# EAGLE board AQ_sensor_GSM (EAGLE 9.6.2), part 1 of 2
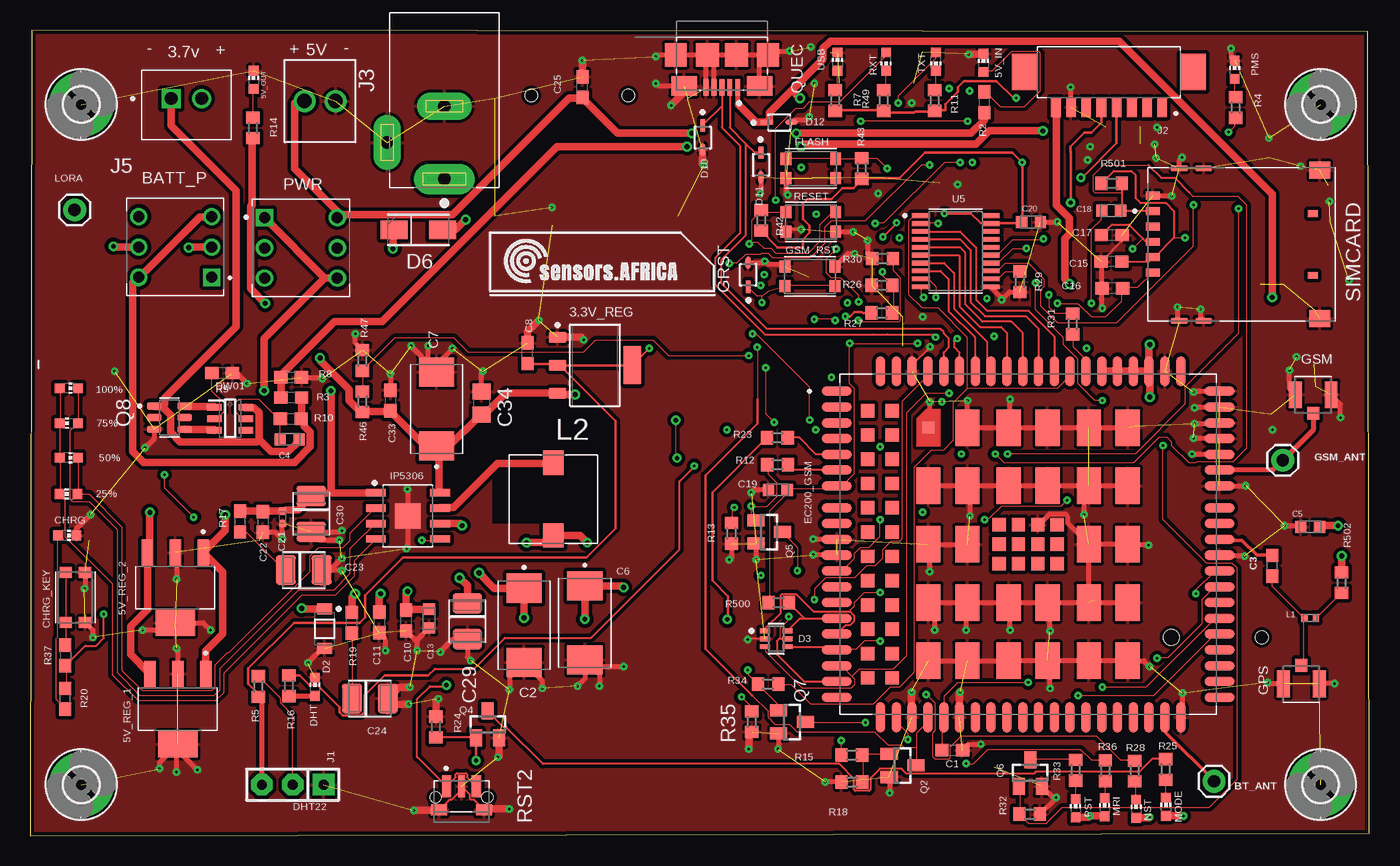
[diagram p8: board, top side]
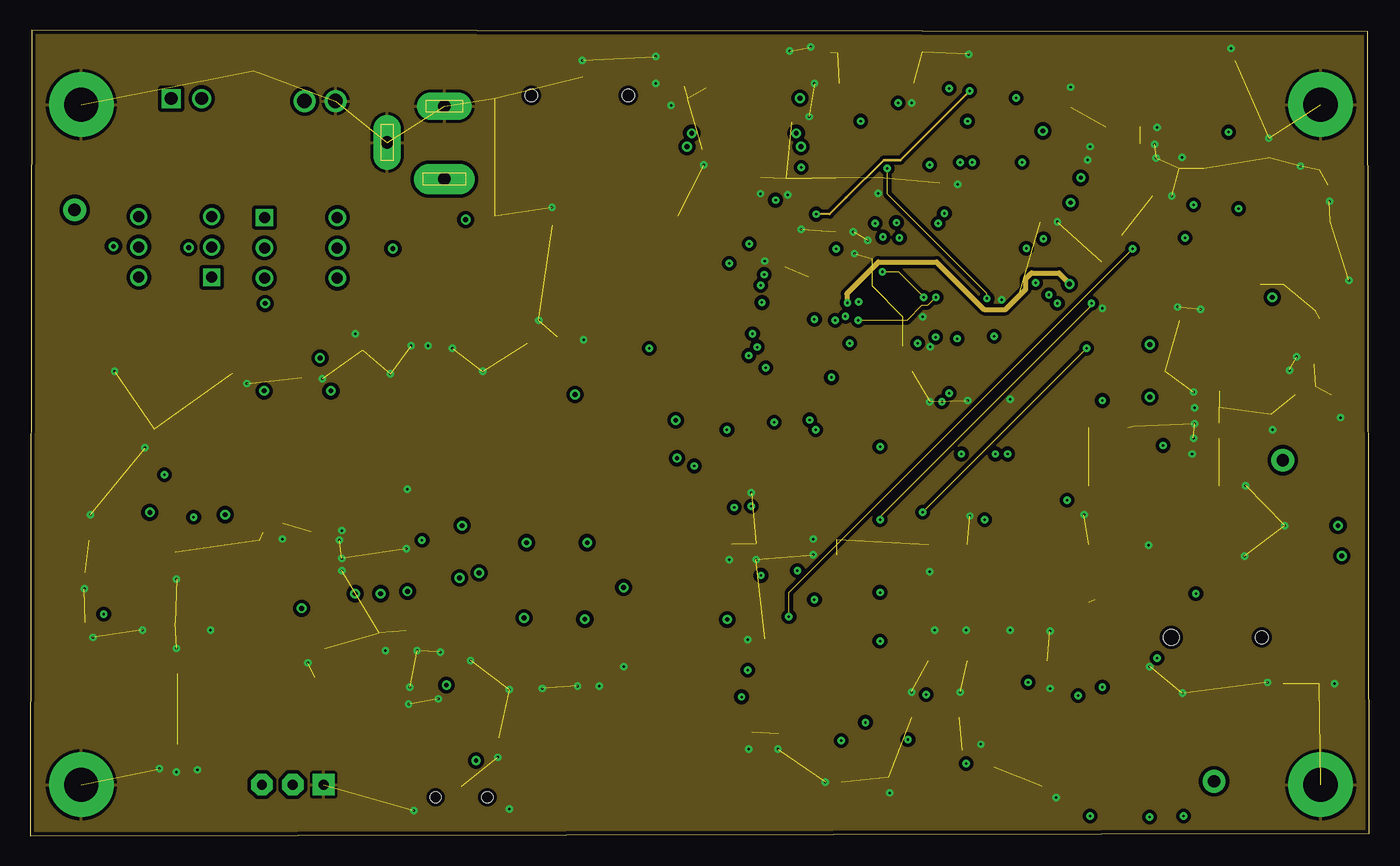
[diagram p9: board, inner layer GND]
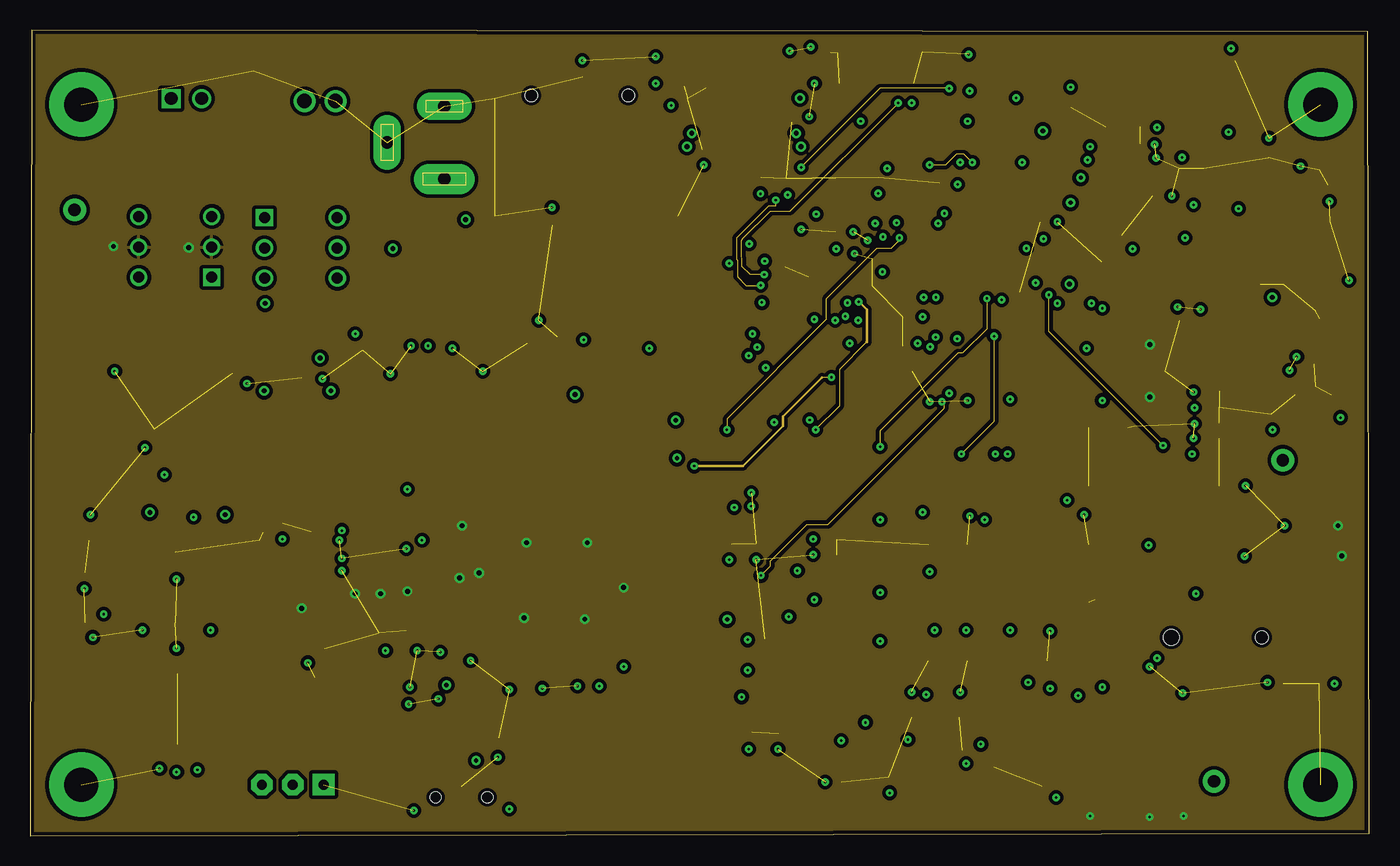
[diagram p10: board, inner layer V_LIPO]
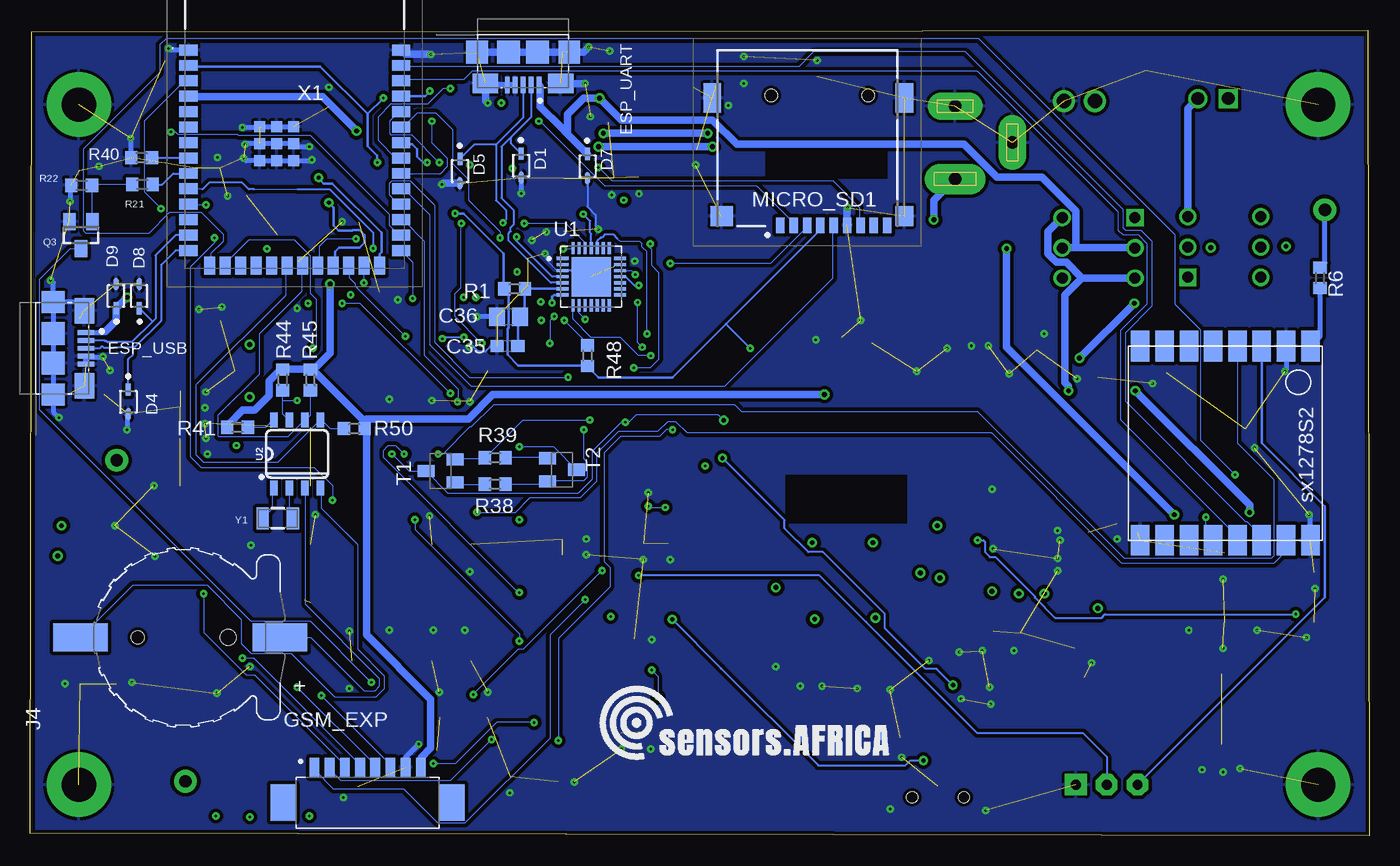
[diagram p11: board, bottom side, seen from below]

Size 110.2 x 66.3 mm. Coordinates in mm from the lower left corner, seen from the top.
Outline: 110.1,66.2 0.1,66.3 0,0 110.2,0.2 110.1,66.2
Copper layers (1+2*15+16): Top 0.035mm / dielectric 1.5mm / GND 0.035mm / dielectric 0.15mm / V_LIPO 0.035mm / dielectric 0.2mm / Bottom 0.035mm
Design rules "default *": minimum track width 0.1mm, minimum drill 0.15mm, track to track 0.3mm, track to pad 0.1mm, pad to pad 0.2mm, via to via 0.3mm, smd to smd 0.3mm, copper to edge 0.3mm, drill to drill 0.3mm, minimum pad ring 10mil, minimum via ring 8mil, stop-mask expansion 4mil, vias tented up to drill 0mil, thermal gap 10mil
Net classes: 0 default: width 0.1 mm, drill 0.2 mm, clearance 0.1 mm; 1 POWER: width 0.2 mm, drill 0.2 mm, clearance 0.2 mm to class 0, clearance 0.2 mm; 2 BGA: width 0.1 mm, drill 0.2 mm; 3 HCurrent: width 0.2 mm, drill 0.2 mm, clearance 0.2 mm to class 0; 4 Antenna: width 0.3 mm, drill 0.2 mm, clearance 0.2 mm to class 0

## Footprints (pad centres in the part's own frame; a part is rotated, then mirrored left to right if it is on the bottom)
TEXAS_INSTRUMENTS_LM1117IMP-3.3-NOPB_0 = smd 1.45 x 0.9: 1 -3.075,2.3; 2 -3.075,0; 3 -3.075,-2.3 | smd 1.45 x 3.15: 4 3.075,0
TERMBLK_254-2N = drill 1.2: 1 0,0; 2 2.54,0
CHIP-LED0603 = smd 0.8 x 0.8: A 0,-0.75; C 0,0.75
VREG_LM7805MPX/NOPB = smd 2.15 x 0.95: 1 -2.9,2.3; 2 -2.9,0; 3 -2.9,-2.3 | smd 2.15 x 3.25: 4 2.9,0
SW_TL2285EE = drill 0.9 square: 1 -2.5,-3 | drill 0.9: 2 0,-3; 3 2.5,-3; 4 -2.5,3; 5 0,3; 6 2.5,3
1X01 = drill 1.016 pad 1.88: 1 0,0
0603 = smd 1.1 x 1: 1 -0.85,0; 2 0.85,0
CAP_20TQC100MYF = smd 2.4 x 2.9: 1 -3.05,0; 2 3.05,0
CAPC1608X90N = smd 0.92 x 0.98: 1 -0.775,0; 2 0.775,0
C0603 = smd 1.1 x 1: 1 -0.85,0; 2 0.85,0
0402-TIGHT = smd 0.6 x 0.6: 1 -0.5,0; 2 0.5,0
CAP_TANT_B = smd 1.66 x 2.42: 1 -1.475,0; 2 1.475,0
C0805 = smd 1.3 x 1.5: 1 -0.95,0; 2 0.95,0
SW_KMR621NGLFS = smd 0.9 x 1: 1_1 -2.05,0.8; 1_2 2.05,0.8; 2_1 -2.05,-0.8; 2_2 2.05,-0.8
ON_SEMI_1N4148WS_0 = smd 1.006 x 0.392: 1 -1,0; 2 1,0
ON_SEMICONDUCTOR_MMSZ5231BT1G_0 = smd 0.91 x 1.22: 1 -1.635,0; 2 1.635,0
SEMTECH_SMF05C_0 = smd 0.85 x 0.4: 1 -0.925,0.65; 2 -0.925,0; 3 -0.925,-0.65; 4 0.925,-0.65; 5 0.925,0; 6 0.925,0.65
DIOM5025X220N = smd 2.25 x 1.55: 1 -2,0; 2 2,0
SOT23-6L = smd 0.55 x 1.2: 1 -0.95,-1.3; 2 0,-1.3; 3 0.95,-1.3; 4 0.95,1.3; 5 0,1.3; 6 -0.95,1.3
XCVR_EC200UCNAB-N05-SNNSA = smd 2.5 x 0.8: 1 -15.75,12.6; 2 -15.75,11.3; 3 -15.75,10; 4 -15.75,8.7; 5 -15.75,7.4; 6 -15.75,6.1; 7 -15.75,4.8; 8 -15.75,0.4; 9 -15.75,-0.9; 10 -15.75,-2.2; 11 -15.75,-3.5; 12 -15.75,-4.8; 13 -15.75,-6.1; 14 -15.75,-7.4; 15 -15.75,-8.7; 16 -15.75,-10; 17 -15.75,-11.3; 18 -15.75,-12.6; 37 15.75,-12.6; 38 15.75,-11.3; 39 15.75,-10; 40 15.75,-8.7; 41 15.75,-7.4; 42 15.75,-6.1; 43 15.75,-4.8; 44 15.75,-3.5; 45 15.75,-2.2; 46 15.75,-0.9; 47 15.75,0.4; 48 15.75,4.8; 49 15.75,6.1; 50 15.75,7.4; 51 15.75,8.7; 52 15.75,10; 53 15.75,11.3; 54 15.75,12.6; 141 -15.75,3; 142 -15.75,1.7; 143 15.75,1.7; 144 15.75,3 | smd 0.8 x 2.5: 19 -9.55,-14.25; 20 -8.25,-14.25; 21 -6.95,-14.25; 22 -5.65,-14.25; 23 -4.35,-14.25; 24 -3.05,-14.25; 25 -1.75,-14.25; 26 -0.45,-14.25; 27 0.85,-14.25; 28 2.15,-14.25; 29 3.45,-14.25; 30 4.75,-14.25; 31 6.05,-14.25; 32 7.35,-14.25; 33 8.65,-14.25; 34 9.95,-14.25; 35 11.25,-14.25; 36 12.55,-14.25; 55 12.55,14.25; 56 11.25,14.25; 57 9.95,14.25; 58 8.65,14.25; 59 7.35,14.25; 60 6.05,14.25; 61 4.75,14.25; 62 3.45,14.25; 63 2.15,14.25; 64 0.85,14.25; 65 -0.45,14.25; 66 -1.75,14.25; 67 -3.05,14.25; 68 -4.35,14.25; 69 -5.65,14.25; 70 -6.95,14.25; 71 -8.25,14.25; 72 -9.55,14.25; 113 -10.85,14.25; 114 -12.15,14.25; 115 -10.85,-14.25; 116 -12.15,-14.25 | smd 1.1 x 1.1: 73 2.4,1.6; 74 2.4,0; 75 2.4,-1.6; 76 0.8,1.6; 77 0.8,0; 78 0.8,-1.6; 79 -0.8,1.6; 80 -0.8,0; 81 -0.8,-1.6; 82 -2.4,1.6; 83 -2.4,0; 84 -2.4,-1.6; 117 -11.2,11; 118 -11.2,9; 119 -11.2,7; 120 -11.2,5; 121 -11.2,3; 122 -11.2,1; 123 -11.2,-1; 124 -11.2,-3; 125 -11.2,-5; 126 -11.2,-7; 127 -11.2,-9; 128 -11.2,-11; 129 -13.2,11; 130 -13.2,9; 131 -13.2,7; 132 -13.2,5; 133 -13.2,3; 134 -13.2,1; 135 -13.2,-1; 136 -13.2,-3; 137 -13.2,-5; 138 -13.2,-7; 139 -13.2,-9; 140 -13.2,-11 | smd 2 x 3: 85 8.2,9.6; 86 8.2,4.8; 87 8.2,0; 88 8.2,-4.8; 89 8.2,-9.6; 90 5,9.6; 91 5,4.8; 92 5,0; 93 5,-4.8; 94 5,-9.6; 95 1.6,9.6; 96 1.6,4.8; 97 1.6,-4.8; 98 1.6,-9.6; 99 -1.6,9.6; 100 -1.6,4.8; 101 -1.6,-4.8; 102 -1.6,-9.6; 103 -5,9.6; 104 -5,4.8; 105 -5,0; 106 -5,-4.8; 107 -5,-9.6; 109 -8.2,4.8; 110 -8.2,0; 111 -8.2,-4.8; 112 -8.2,-9.6 | smd 1 x 1: 108 -8.2,9.6
AMPHENOL_10118192-0001LF = smd 0.4 x 1.35: 1 -1.3,0; 2 -0.65,0; 3 0,0; 4 0.65,0; 5 1.3,0 | smd 2.1 x 1.6: SH1 -3.1,-0.125; SH2 3.1,-0.125 | smd 1.8 x 1.9: SH3 -3.8,-2.675; SH6 3.8,-2.675 | smd 1.9 x 1.9: SH4 -1.2,-2.675; SH5 1.2,-2.675
TE_1909763-1 = smd 1 x 1.05: 1 0,-1.525 | smd 1.05 x 2.2: 2 -1.475,0; 3 1.475,0
MOLEX_53261-0871 = smd 0.8 x 1.6: 1 -4.375,2.9; 2 -3.125,2.9; 3 -1.875,2.9; 4 -0.625,2.9; 5 0.625,2.9; 6 1.875,2.9; 7 3.125,2.9; 8 4.375,2.9 | smd 2.1 x 3: S1 -6.925,0; S2 6.925,0
2,8-PAD = drill 2.8 pad 5.334: B2,8 0,0
SOIC127P600X165-9T209N = smd 1.609 x 0.594: 1 -2.653,1.905; 2 -2.653,0.635; 3 -2.653,-0.635; 4 -2.653,-1.905; 5 2.653,-1.905; 6 2.653,-0.635; 7 2.653,0.635; 8 2.653,1.905 | smd 2.09 x 2.09: 9 0,0
SIP-100-03-32 = drill 0.813 pad 1.778 square: 1 -2.54,0 | drill 0.813 pad 1.778 octagon: 2 0,0; 3 2.54,0
CUI_PJ-002BH = drill 1 pad 2.5 long: 1 0,0 | drill 1 pad 2.25 long: 2 6,0; 3 3,4.7
HARWIN_S8411-45R = smd 2.3 x 4.5: N 0,8.425; P 0,-7.975 | hole 1.05: 0,3.725 | hole 1.3: 0,-3.725
JST_B2B-XH-A = drill 1.05 square: 1 1.25,-0.525 | drill 1.05: 2 -1.25,-0.525
INDC1005X60N = smd 0.51 x 0.63: 1 -0.46,0; 2 0.46,0
784778010 = smd 1.7 x 2: 1 0,3; 2 0,-3
TF-01A = smd 0.7 x 1.3: 1 2.23,7.174; 2 1.13,7.174; 3 0.03,7.174; 4 -1.07,7.174; 5 -2.17,7.174; 6 -3.27,7.174; 7 -4.37,7.174; 8 -5.47,7.174; CD1 -6.57,7.174 | smd 1.448 x 1.651: MP1 -7.989,6.4 | smd 1.448 x 2.438: MP2 -7.989,-3.3; MP3 7.836,-3.3 | smd 1.854 x 1.651: MP4 7.061,6.4 | hole 1: -5.004,-3.531; 2.972,-3.531
SOT23-BEC = smd 1 x 1.4: B -0.95,-1.1; C 0,1.1; E 0.95,-1.1
SOT95P280X145-6N = smd 1.21 x 0.59: 1 -1.255,0.95; 2 -1.255,0; 3 -1.255,-0.95; 4 1.255,-0.95; 5 1.255,0; 6 1.255,0.95
R0603 = smd 1 x 1.1: 1 -0.85,0; 2 0.85,0
SW_SKRTLAE010 = smd 0.75 x 1.8: 1 -1.225,0.9; 3 1.225,0.9 | smd 0.6 x 1.8: 2 0,0.9 | smd 1.3 x 0.9: S1 -1.85,-1.05; S2 1.85,-1.05 | hole 0.9: -2.125,0; 2.125,0
MOLEX_78646-3001 = smd 1.15 x 0.65: C1 -7.295,2.755; C2 -7.295,0.215; C3 -7.295,-2.325; C5 -7.295,4.025; C6 -7.295,1.485; C7 -7.295,-1.055 | smd 1.3 x 0.45: G1 -5.125,6.27; G2 -3.125,6.27; G3 -5.125,-6.27; G4 -3.125,-6.27 | smd 1.7 x 1.4: G5 6.435,-6.105; G6 6.435,6.105 | smd 0.8 x 0.54: X1 5.855,2.54; X2 5.855,-2.54
SC59-BEC = smd 1 x 1.4: B -0.95,-1.2; C 0,1.2; E 0.95,-1.2
QFN50P500X500X80-29N = smd 0.99 x 0.27: 1 -2.36,1.5; 2 -2.36,1; 3 -2.36,0.5; 4 -2.36,0; 5 -2.36,-0.5; 6 -2.36,-1; 7 -2.36,-1.5; 15 2.36,-1.5; 16 2.36,-1; 17 2.36,-0.5; 18 2.36,0; 19 2.36,0.5; 20 2.36,1; 21 2.36,1.5 | smd 0.27 x 0.99: 8 -1.5,-2.36; 9 -1,-2.36; 10 -0.5,-2.36; 11 0,-2.36; 12 0.5,-2.36; 13 1,-2.36; 14 1.5,-2.36; 22 1.5,2.36; 23 1,2.36; 24 0.5,2.36; 25 0,2.36; 26 -0.5,2.36; 27 -1,2.36; 28 -1.5,2.36 | smd 3.25 x 3.25: 29 0,0
SO08-0.15 = smd 0.6 x 1.2: 1 -1.905,-2.8; 2 -0.635,-2.8; 3 0.635,-2.8; 4 1.905,-2.8; 5 1.905,2.8; 6 0.635,2.8; 7 -0.635,2.8; 8 -1.905,2.8
SOP65P640X120-20N = smd 1.57 x 0.41: 1 -2.87,2.925; 2 -2.87,2.275; 3 -2.87,1.625; 4 -2.87,0.975; 5 -2.87,0.325; 6 -2.87,-0.325; 7 -2.87,-0.975; 8 -2.87,-1.625; 9 -2.87,-2.275; 10 -2.87,-2.925; 11 2.87,-2.925; 12 2.87,-2.275; 13 2.87,-1.625; 14 2.87,-0.975; 15 2.87,-0.325; 16 2.87,0.325; 17 2.87,0.975; 18 2.87,1.625; 19 2.87,2.275; 20 2.87,2.925
SX1278 = smd 2.54 x 1.524: 1 -9,5; 2 -9,3; 3 -9,1; 4 -9,-1; 5 -9,-3; 6 -9,-5; 7 -9,-7; 8 -9,-9; 9 7,-9; 10 7,-7; 11 7,-5; 12 7,-3; 13 7,-1; 14 7,1; 15 7,3; 16 7,5
ESP32S3WROOM1N8R2 = smd 1.5 x 0.9: 1 -8.75,5.26; 2 -8.75,3.99; 3 -8.75,2.72; 4 -8.75,1.45; 5 -8.75,0.18; 6 -8.75,-1.09; 7 -8.75,-2.36; 8 -8.75,-3.63; 9 -8.75,-4.9; 10 -8.75,-6.17; 11 -8.75,-7.44; 12 -8.75,-8.71; 13 -8.75,-9.98; 14 -8.75,-11.25; 27 8.75,-11.25; 28 8.75,-9.98; 29 8.75,-8.71; 30 8.75,-7.44; 31 8.75,-6.17; 32 8.75,-4.9; 33 8.75,-3.63; 34 8.75,-2.36; 35 8.75,-1.09; 36 8.75,0.18; 37 8.75,1.45; 38 8.75,2.72; 39 8.75,3.99; 40 8.75,5.26 | smd 0.9 x 1.5: 15 -6.985,-12.5; 16 -5.715,-12.5; 17 -4.445,-12.5; 18 -3.175,-12.5; 19 -1.905,-12.5; 20 -0.635,-12.5; 21 0.635,-12.5; 22 1.905,-12.5; 23 3.175,-12.5; 24 4.445,-12.5; 25 5.715,-12.5; 26 6.985,-12.5 | smd 0.9 x 0.9: 41 -1.5,-2.46; 42 -1.5,-1.06; 43 -2.9,-1.06; 44 -2.9,-2.46; 45 -2.9,-3.86; 46 -1.5,-3.86; 47 -0.1,-3.86; 48 -0.1,-2.46; 49 -0.1,-1.06
CRYSTAL-SMD-3.2X1.5MM = smd 1 x 1.8: P$1 -1.25,0; P$2 1.25,0

## Placement (x,y rotation side)
3.3V_REG  TEXAS_INSTRUMENTS_LM1117IMP-3.3-NOPBTEXAS_INSTRUMENTS_LM1117IMP-3.3-NOPB_0_0  [TEXAS_INSTRUMENTS_LM1117IMP-3.3-NOPB_0]  46.47,38.73 0 top
5V  2828XX-2282834-2  [TERMBLK_254-2N]  22.57,60.47 0 top
5V_IN  ORANGE  [CHIP-LED0603]  78.45,63.63 0 top
5V_OUT  RED  [CHIP-LED0603]  18.37,62.24 0 top
5V_REG_1  LM7805MPX/NOPB  [VREG_LM7805MPX/NOPB]  12.14,10.42 270 top
5V_REG_2  LM7805MPX/NOPB  [VREG_LM7805MPX/NOPB]  11.94,20.42 270 top
25%  ORANGE  [CHIP-LED0603]  3.14,28.13 90 top
50%  ORANGE  [CHIP-LED0603]  3.16,31.1 270 top
75%  ORANGE  [CHIP-LED0603]  3.16,33.96 90 top
100%  ORANGE  [CHIP-LED0603]  3.16,36.84 270 top
BATT_P  TL2285EE  [SW_TL2285EE]  11.93,48.47 90 top
BT_ANT  [1X01]  97.44,4.48 180 top
C1  10nF  [0603]  75.88,7.04 0 top
C2  20TQC100MYF  [CAP_20TQC100MYF]  40.64,17.32 270 top
C3  100pF  [0603]  102.24,22.22 90 top
C4  100nf  [CAPC1608X90N]  21.34,32.62 0 top
C5  100nf  [CAPC1608X90N]  105.34,25.42 0 top
C6  20TQC100MYF  [CAP_20TQC100MYF]  45.64,17.52 270 top
C7  20TQC100MYF  [CAP_20TQC100MYF]  33.44,35.12 90 top
C8  10uF  [C0603]  40.92,39.71 90 top
C10  33pF  [C0603]  30.91,17.71 270 top
C11  10pF  [C0603]  28.72,17.56 270 top
C13  100nf  [CAPC1608X90N]  32.83,17.87 90 top
C15  33pF  [C0603]  89,47.27 180 top
C16  33pF  [C0603]  89.07,45.05 180 top
C17  33pF  [C0603]  89.01,49.44 0 top
C18  100nf  [CAPC1608X90N]  88.97,51.46 0 top
C19  100nf  [CAPC1608X90N]  61.53,28.47 0 top
C20  100nf  [CAPC1608X90N]  82.36,50.51 180 top
C21  22pF  [0402-TIGHT]  20.76,26.2 270 top
C22  0.1uF  [C0603]  19.14,25.82 270 top
C23  TAJB106K016RNJ  [CAP_TANT_B]  22.5,21.86 0 top
C24  TAJB106K016RNJ  [CAP_TANT_B]  27.95,11.29 0 top
C25  1.0uF  [C0603]  45.44,61.62 90 top
C29  TAJB106K016RNJ  [CAP_TANT_B]  35.97,17.65 270 top
C30  TAJB106K016RNJ  [CAP_TANT_B]  23.11,26.49 270 top
C33  10uF  [C0603]  29.64,35.82 270 top
C34  100nF  [C0805]  37.14,35.62 270 top
C35  10uF  [C0603]  70.94,40.32 0 bottom
C36  100nF  [C0805]  70.84,42.72 0 bottom
CHRG  ORANGE  [CHIP-LED0603]  3.04,24.72 270 top
CHRG_KEY  KMR621NGLFS  [SW_KMR621NGLFS]  3.7,19.61 90 top
D1  ON_SEMI_1N4148WSON_SEMI_1N4148WS_0_0  [ON_SEMI_1N4148WS_0]  69.81,55.16 270 bottom
D2  ON_SEMICONDUCTOR_MMSZ5231BT1GON_SEMICONDUCTOR_MMSZ5231BT1G_0_0  [ON_SEMICONDUCTOR_MMSZ5231BT1G_0]  24.22,17.04 270 top
D3  SEMTECH_SMF05CSEMTECH_SMF05C_0_0  [SEMTECH_SMF05C_0]  61.4,16.21 0 top
D4  ON_SEMI_1N4148WSON_SEMI_1N4148WS_0_0  [ON_SEMI_1N4148WS_0]  102.14,35.72 270 bottom
D5  ON_SEMI_1N4148WSON_SEMI_1N4148WS_0_0  [ON_SEMI_1N4148WS_0]  74.84,54.72 270 bottom
D6  SS54-HF  [DIOM5025X220N]  31.94,49.87 0 top
D7  ON_SEMI_1N4148WSON_SEMI_1N4148WS_0_0  [ON_SEMI_1N4148WS_0]  64.34,55.12 270 bottom
D8  ON_SEMI_1N4148WSON_SEMI_1N4148WS_0_0  [ON_SEMI_1N4148WS_0]  101.24,44.42 90 bottom
D9  ON_SEMI_1N4148WSON_SEMI_1N4148WS_0_0  [ON_SEMI_1N4148WS_0]  103.14,44.42 90 bottom
D10  ON_SEMI_1N4148WSON_SEMI_1N4148WS_0_0  [ON_SEMI_1N4148WS_0]  55.34,57.48 270 top
D11  ON_SEMI_1N4148WSON_SEMI_1N4148WS_0_0  [ON_SEMI_1N4148WS_0]  60.14,55.22 270 top
D12  ON_SEMI_1N4148WSON_SEMI_1N4148WS_0_0  [ON_SEMI_1N4148WS_0]  61.64,58.72 0 top
DHT  GREEN  [CHIP-LED0603]  23.42,12.26 0 top
DW01  DW01-P  [SOT23-6L]  16.44,34.32 270 top
EC200_GSM  EC200UCNAB-N05-SNNSA  [XCVR_EC200UCNAB-N05-SNNSA]  82.13,23.99 0 top
ESP_UART  10118192-0001LF  [AMPHENOL_10118192-0001LF]  69.64,61.82 180 bottom
ESP_USB  10118192-0001LF  [AMPHENOL_10118192-0001LF]  105.64,40.12 270 bottom
FLASH  KMR621NGLFS  [SW_KMR621NGLFS]  64.24,54.92 0 top
GPS  1909763-1  [TE_1909763-1]  104.62,12.49 180 top
GRST  ON_SEMI_1N4148WSON_SEMI_1N4148WS_0_0  [ON_SEMI_1N4148WS_0]  59.09,46.18 90 top
GSM  1909763-1  [TE_1909763-1]  105.59,36.31 0 top
GSM_ANT  1.9Ghz - 2.4Ghz  [1X01]  103.09,30.9 180 top
GSM_EXP  53261-0871  [MOLEX_53261-0871]  82.44,2.72 0 bottom
GSM_RST  KMR621NGLFS  [SW_KMR621NGLFS]  64.17,46.05 0 top
H1  MOUNT-PAD-ROUND2.8  [2,8-PAD]  4.2,60.2 180 top
H2  MOUNT-PAD-ROUND2.8  [2,8-PAD]  4.2,4.2 180 top
H3  MOUNT-PAD-ROUND2.8  [2,8-PAD]  106.2,4.2 180 top
H4  MOUNT-PAD-ROUND2.8  [2,8-PAD]  106.2,60.2 180 top
IP5306  IP5306  [SOIC127P600X165-9T209N]  31.07,26.32 0 top
J1  F-1X03-SIP-100-32  [SIP-100-03-32]  21.6,4.2 180 top
J2  53261-0871  [MOLEX_53261-0871]  88.79,62.86 180 top
J3  PJ-002BH  [CUI_PJ-002BH]  34.08,54.07 90 top
J4  S8411-45R  [HARWIN_S8411-45R]  97.64,16.32 90 bottom
J5  B2B-XH-A  [JST_B2B-XH-A]  12.85,60.16 180 top
L1  LQW15AN47NG00D  [INDC1005X60N]  105.34,17.92 0 top
L2  784778010  [784778010]  43.05,27.71 0 top
LORA  [1X01]  3.64,51.52 0 top
MICRO_SD1  TF-01A  [TF-01A]  46.24,57.42 180 bottom
MODE  ORANGE  [CHIP-LED0603]  93.47,2.39 0 top
MRI  ORANGE  [CHIP-LED0603]  88.43,2.35 0 top
NST  ORANGE  [CHIP-LED0603]  91.02,2.23 0 top
PMS  ORANGE  [CHIP-LED0603]  99.13,63.05 0 top
PST  ORANGE  [CHIP-LED0603]  86.03,2.26 0 top
PWR  TL2285EE  [SW_TL2285EE]  22.27,48.39 270 top
Q2  MMBT2222  [SOT23-BEC]  71.79,5.78 270 top
Q3  MMBT2222  [SOT23-BEC]  106.04,49.43 180 bottom
Q4  MMBT2222  [SOT23-BEC]  37.64,9.16 0 top
Q5  MMBT2222  [SOT23-BEC]  60.81,25 270 top
Q6  MMBT2222  [SOT23-BEC]  82.31,5.16 0 top
Q7  MMBT2222  [SOT23-BEC]  62.69,9.36 270 top
Q8  FS8205  [SOT95P280X145-6N]  11.44,34.42 0 top
QUEC  10118192-0001LF  [AMPHENOL_10118192-0001LF]  56.92,61.6 180 top
R1  0R  [R0603]  70.34,45.02 180 bottom
R2  1k  [0603]  78.54,60.38 90 top
R3  47k  [0603]  21.48,36.06 180 top
R4  470R  [R0603]  99.21,59.94 270 top
R5  4.7K  [R0603]  18.78,12.28 90 top
R6  0R  [R0603]  4.04,45.92 270 bottom
R7  200  [R0603]  66.24,60.52 270 top
R8  10k  [0603]  21.47,37.74 0 top
R9  1k  [0603]  15.79,38.1 0 top
R10  100R  [0603]  21.44,34.32 0 top
R11  200  [R0603]  74.44,60.52 270 top
R12  4.7K  [R0603]  61.5,30.55 180 top
R13  47K  [R0603]  57.71,24.89 90 top
R14  1K  [R0603]  18.33,58.26 270 top
R15  4.7K  [R0603]  67.62,6.63 0 top
R16  470R  [R0603]  21.29,12.34 90 top
R17  2R  [0603]  17.27,25.85 90 top
R18  47K  [R0603]  67.62,4.42 0 top
R19  2R  [0603]  26.46,17.53 90 top
R20  220R  [0603]  2.88,11.27 90 top
R21  4.7K  [R0603]  100.98,53.61 180 bottom
R22  47K  [R0603]  105.98,53.54 0 bottom
R23  4.7K  [R0603]  61.49,32.76 180 top
R24  47K  [R0603]  33.39,8.95 270 top
R25  470R  [R0603]  93.43,5.46 270 top
R26  120K  [R0603]  70.1,45.3 180 top
R27  10K  [R0603]  70.09,43.03 0 top
R28  470R  [R0603]  90.9,5.32 270 top
R29  51K  [R0603]  81.45,45.61 270 top
R30  51K  [R0603]  70.14,47.51 180 top
R31  4.7K  [R0603]  85.78,42.12 90 top
R32  47K  [R0603]  82.26,1.76 180 top
R33  470R  [R0603]  86.03,5.39 270 top
R34  4.7K  [R0603]  60.73,12.48 180 top
R35  47K  [R0603]  59.39,9.39 90 top
R36  470R  [R0603]  88.49,5.34 270 top
R37  10k  [0603]  2.87,14.84 270 top
R38  10K  [R0603]  71.94,28.92 180 bottom
R39  10K  [R0603]  71.94,31.12 0 bottom
R40  10K  [R0603]  101.04,55.82 180 bottom
R41  0R  [R0603]  93.14,33.62 180 bottom
R42  10K  [R0603]  60.15,50.65 270 top
R43  10K  [R0603]  68.44,54.92 270 top
R44  47K  [R0603]  89.44,37.52 270 bottom
R45  47K  [R0603]  87.14,37.52 270 bottom
R46  20K  [R0603]  27.34,35.72 90 top
R47  47K  [R0603]  27.34,39.12 90 top
R48  10K  [R0603]  64.34,39.52 270 bottom
R49  200  [R0603]  70.24,60.52 270 top
R50  47K  [R0603]  83.54,33.52 180 bottom
R500  4.7K  [R0603]  61.6,19.18 180 top
R501  4.7K  [R0603]  89.01,53.69 0 top
R502  10R  [R0603]  107.94,20.82 90 top
RESET  KMR621NGLFS  [SW_KMR621NGLFS]  64.24,50.52 0 top
RST2  SKRTLAE010  [SW_SKRTLAE010]  35.49,3.16 0 top
RXT  [CHIP-LED0603]  70.44,63.72 180 top
SIMCARD  78646-3001  [MOLEX_78646-3001]  99.7,48.67 0 top
T1  S8050  [SC59-BEC]  76.44,30.02 90 bottom
T2  S8050  [SC59-BEC]  66.44,30.12 270 bottom
TXT  [CHIP-LED0603]  74.54,63.72 180 top
U1  CP2102N-A02-GQFN28  [QFN50P500X500X80-29N]  64.04,46.02 0 bottom
U2  DS1307Z  [SO08-0.15]  88.24,31.42 0 bottom
U5  TXS0108EPWR  [SOP65P640X120-20N]  76.18,48.12 0 top
U$1  SX1278  [SX1278]  9.84,31.32 270 bottom
USB  [CHIP-LED0603]  66.44,63.72 0 top
X1  ESP32-S3-WROOM-1-N16R8  [ESP32S3WROOM1N8R2]  88.44,59.42 0 bottom
Y1  32.768kHz  [CRYSTAL-SMD-3.2X1.5MM]  89.84,26.12 180 bottom